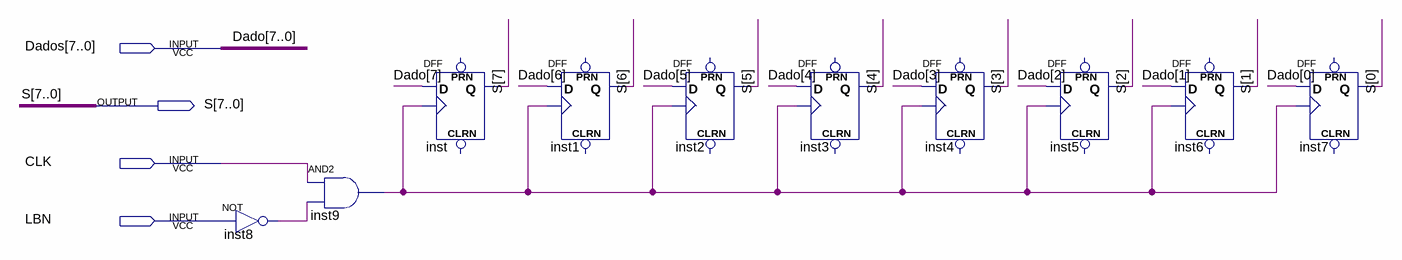
[diagram p0: schematic sheet]
// Quartus schematic Registrador_B.bdf as structural Verilog: 10 symbols, 4 pins
module Registrador_B (
  input  [7:0] Dados,
  input  CLK,
  input  LBN,
  output [7:0] S
);

  wire inst8_out, inst9_out;

  not inst8 (inst8_out, LBN);
  and inst9 (inst9_out, CLK, inst8_out);
  DFF inst (.CLK(inst9_out), .D(Dados[7]), .Q(S[7]));  // open: CLRN, PRN
  DFF inst1 (.CLK(inst9_out), .D(Dados[6]), .Q(S[6]));  // open: CLRN, PRN
  DFF inst2 (.CLK(inst9_out), .D(Dados[5]), .Q(S[5]));  // open: CLRN, PRN
  DFF inst3 (.CLK(inst9_out), .D(Dados[4]), .Q(S[4]));  // open: CLRN, PRN
  DFF inst4 (.CLK(inst9_out), .D(Dados[3]), .Q(S[3]));  // open: CLRN, PRN
  DFF inst5 (.CLK(inst9_out), .D(Dados[2]), .Q(S[2]));  // open: CLRN, PRN
  DFF inst6 (.CLK(inst9_out), .D(Dados[1]), .Q(S[1]));  // open: CLRN, PRN
  DFF inst7 (.CLK(inst9_out), .D(Dados[0]), .Q(S[0]));  // open: CLRN, PRN

  // Other names for the same wires on the sheet: Dado[7:0] = Dados
endmodule
